# EasyEDA Pro project STM_Preamplifier.eprj

# Schematic tunnelAmp
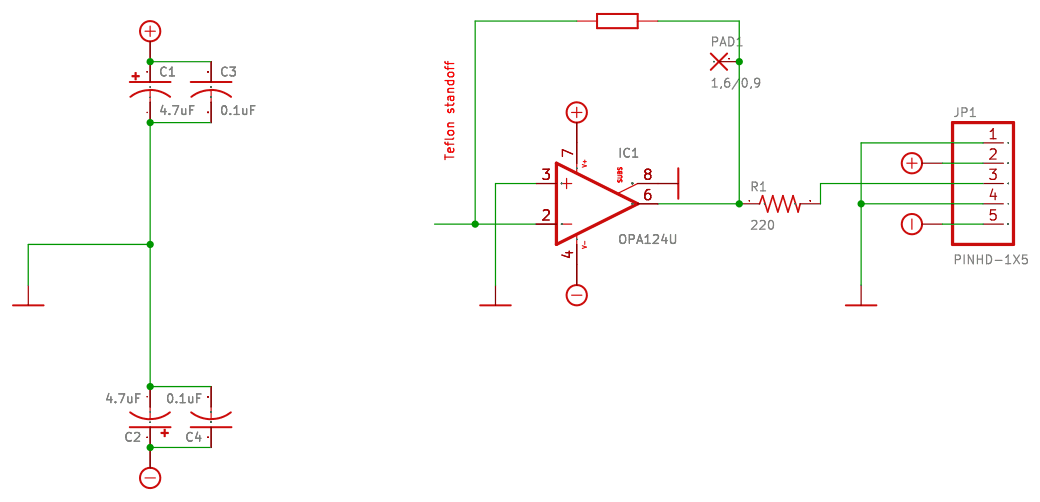
[diagram p0: schematic sheet]

## Parts
C1  4.7uF  [C/6032-28W]
C2  4.7uF  [C/6032-28W]
C3  0.1uF  [C0603]
C4  0.1uF  [C0603]
IC1  OPA124U  [SO08]
JP1  PINHD-1X5  [1X05]
PAD1  1,6/0,9  [1,6/0,9]
R1  220  [R0603]
R3  100M

## Library data of the parts
C1 C2 = resistor_CPOL-US_C/6032-28W
C3 C4 = resistor_C-US_C0603
IC1 = burr-brown_OPA124U_
JP1 = pinhead_PINHD-1X5_
PAD1 = wirepad_1,6/0,9_
R1 = resistor_R-US__R0603
R3 = docu-dummy_R_

## Nets
+9V: C1.+ C3.1 IC1.7(V+) JP1.2
-9V: C2.+ C4.1 IC1.4(V-) JP1.5
GND: C1.- C2.- C3.2 C4.2 IC1.3(+IN) IC1.8(SUBS) JP1.1 JP1.4
N$1: IC1.6(OUT) PAD1.1(P) R1.1
N$2: JP1.3 R1.2
N$4: IC1.2(-IN)

## Notes on the sheet
- Teflon standoff

# Board tunnelAmp
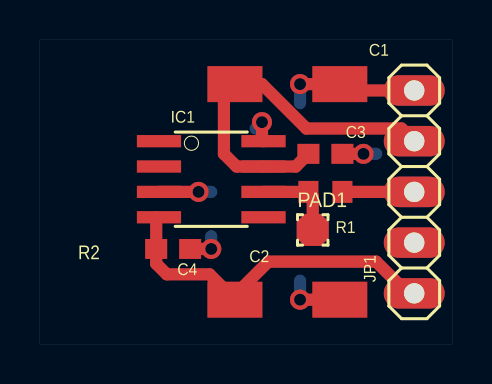
[diagram p1: board, top side]
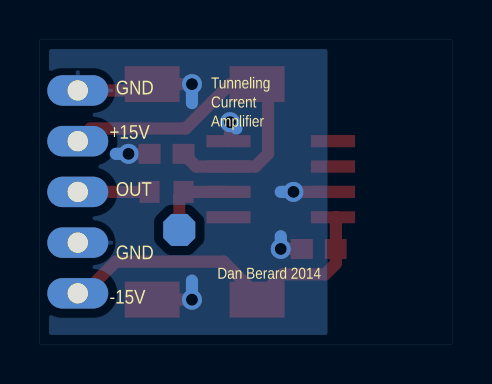
[diagram p2: board, bottom side, seen from below]

Outline 20.62 x 15.23 mm; copper layers: Top Layer, Bottom Layer. Coordinates in mm from the lower left corner of the outline.
Outline path: 0,15.23 0,0 20.62,0 20.62,15.23 0,15.23
Stack: Top Layer 0.035mm / Dielectric1 1.51mm FR4 er 4.5 / Bottom Layer 0.035mm

## Design rules (mm)
spacing safeClearance (default): track to track 0.203, other pairs 0 to 0.508
track width trackWidth: min 0.254, default 0.254, max 2.54
track width default (default): min 0.003, default 0.003, max 2.54
differential pair differentialPair (default): width min 0.127, default 0.254, max 2.54; gap min 0.152, default 0.152
via viaSize: diameter min 0.61, default 0.61, max 2.6; hole min 0.61, default 0.61, max 2
via default (default): diameter min 0, default 0, max 2.6; hole min 0, default 0, max 2
pour ie46 uses CopperRegion

## Placement (name value [footprint] x y rotation side)
C1  4.7uF  [C/6032-28W]  12.38 13.02 180 top
C2  4.7uF  [C/6032-28W]  12.38 2.22 180 top
C3  0.1uF  [C0603]  14.29 9.53 0 top
C4  0.1uF  [C0603]  6.67 4.76 0 top
IC1  OPA124U  [SO08]  8.57 8.25 270 top
JP1  PINHD-1X5  [1X05]  18.73 7.62 270 top
PAD1  wirepad_1,6/0,9_  [1,6/0,9]  13.65 5.72 0 top
R1  220  [R0603]  14.29 7.62 0 top

## Footprints (pads in the part's own frame, mm; a bottom-side part is the same pattern mirrored in y, then rotated)
1,6/0,9
  custom 1.6x1.6 hole 0.914: 1(0,0)
1X05
  oval 1.524x3.048 hole 1.016: 1(-5.08,0) 2(-2.54,0) 3(0,0) 4(2.54,0) 5(5.08,0)
C0603
  rect 1.1x1 smd: 1(-0.85,0) 2(0.85,0)
C/6032-28W
  rect 2.75x1.8 smd: +(2.625,0) -(-2.625,0)
R0603
  rect 1x1.1 smd: 1(-0.85,0) 2(0.85,0)
SO08
  rect 0.61x2.21 smd: 1(-1.905,-2.616) 2(-0.635,-2.616) 3(0.635,-2.616) 4(1.905,-2.616) 5(1.905,2.616) 6(0.635,2.616) 7(-0.635,2.616) 8(-1.905,2.616)

## Nets
As in the schematic.

Pads without a net: IC1 1 5

## Via types
v1: diameter 1.006, hole 0.6, Top Layer to Bottom Layer, 6 vias

## Routing (per net, layer and track width the routed paths; a pad name or vN(x,y) marks a point on that pad's centre or on a via; arc(x,y) is an arc through that point)
+9V: length 18.6
  Top Layer w0.61: C3.1 12.8,8.89 IC1.7 9.84,8.89 9.21,9.53 9.21,12.47 C1.+ 11.11,13.02 13.34,10.8 18.1,10.8 JP1.2
-9V: length 17.7
  Top Layer w0.406: IC1.4 5.82,6.35
  Top Layer w0.61: 5.82,6.35 C4.1 5.82,4.03 6.35,3.49 8.49,3.49 C2.+ 9.84,2.54 11.43,4.13 16.83,4.13 18.41,2.54 JP1.5
GND: length 17.5
  Top Layer w0.61: v1(11.11,11.11) 11.11,10.24 IC1.8 ; v1(13.02,13.02) C1.- 15.32,12.7 19.05,12.7 ; C4.2 v1(8.57,4.76) ; IC1.3 v1(7.94,7.62) ; C2.- v1(13.02,2.22) ; C3.2 v1(16.19,9.53)
  Bottom Layer w0.61: v1(16.19,9.53) 16.83,9.53 ; v1(11.11,11.11) 10.79,10.8 ; v1(13.02,2.22) 13.02,3.17 ; v1(13.02,13.02) 13.02,12.06 ; 8.57,7.62 v1(7.94,7.62) ; v1(8.57,4.76) 8.57,5.4
N$1: length 4.2
  Top Layer w0.61: PAD1.1 13.65,7.41 R1.1 IC1.6
N$2: length 3.6
  Top Layer w0.61: R1.2 JP1.3

## Copper pours and planes (outline as drawn; the poured copper is in the pictures)
GND on Bottom Layer: 6.03,15.24 20.64,15.24 20.64,0 6.03,0

## Text on the board
Bottom Silkscreen Layer: Dan Berard 2014 | Tunneling / Current / Amplifier | GND | OUT | +15V | -15V
Top Silkscreen Layer: R2
